# EAGLE design maplebacon-bom5k (EAGLE 5.11)
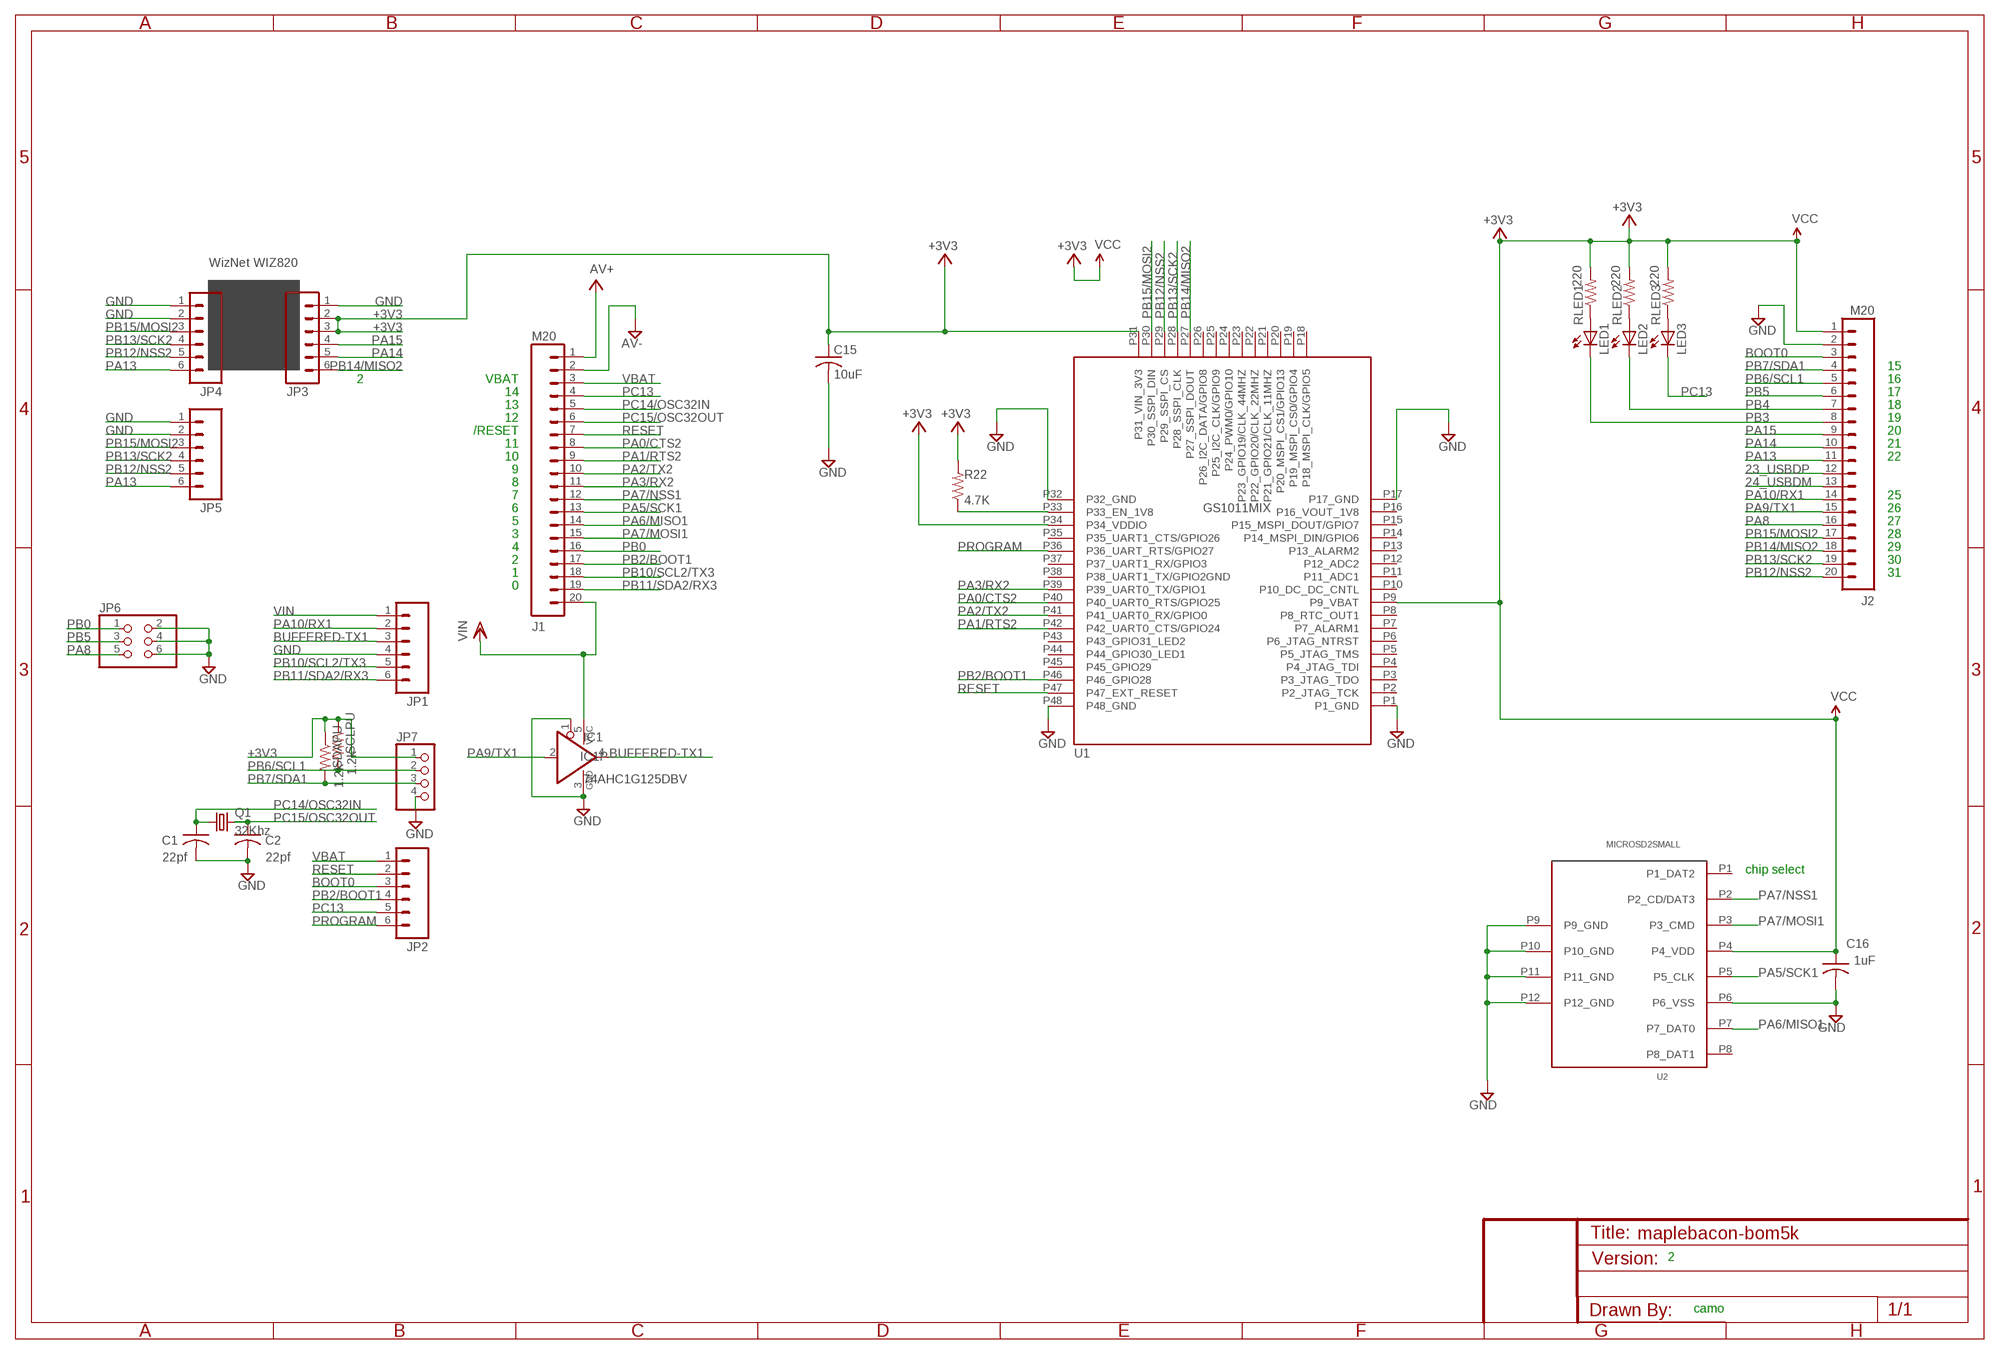
[diagram p0: schematic, sheet 1]

## Parts
C1  22pf  C-USC0603  [C0603]
C2  22pf  C-USC0603  [C0603]
C15  10uF  C-USC0603  [C0603]
C16  1uF  C-USC0603  [C0603]
IC1  74AHC1G125DBV  [SOT23-5]
J1  M20  [1X20]
J2  M20  [1X20]
JP1  M06SIP  [1X06]
JP2  M06SIP  [1X06]
JP3  M06SIP  [1X06]
JP4  M06SIP  [1X06]
JP5  M06SIP  [1X06]
JP6  PINHD-2X3  [2X03]
JP7  PINHD-1X4  [1X04]
LED1  LED3MM  [LED3MM]
LED2  LED3MM  [LED3MM]
LED3  LED3MM  [LED3MM]
Q1  32Khz  CRYSTALTC38H  [TC38H]
R22  4.7K  R-US_R0603  [R0603]
RLED1  220  R-US_R0603  [R0603]
RLED2  220  R-US_R0603  [R0603]
RLED3  220  R-US_R0603  [R0603]
SCLPU  1.2k  R-US_R0603  [R0603]
SDAPU  1.2k  R-US_R0603  [R0603]
U1  GS1011MIX  [GS1011MIX]
U2  MICROSD2SMALL  [MICROSD3]

## Nets
23_USBDP: J2.12
24_USBDM: J2.13
+3V3: C15.1 C16.1 J2.1 JP3.2 JP3.3 JP7.1 R22.2 RLED1.2 RLED2.2 RLED3.2 SCLPU.1 SDAPU.1 U1.P9(P9_VBAT) U1.P31(P31_VIN_3V3) U1.P34(P34_VDDIO) U2.P4(P4_VDD) ; supply symbol labelled VCC
AGND: J1.2 ; supply symbol labelled AV-
BOOT0: J2.3 JP2.3
BUFFERED-TX1: IC1.4(O) JP1.3
GND: C1.2 C2.2 C15.2 C16.2 IC1.1(OE) IC1.3(GND) J2.2 JP1.4 JP3.1 JP4.1 JP4.2 JP5.1 JP5.2 JP6.2 JP6.4 JP6.6 JP7.4 U1.P1(P1_GND) U1.P17(P17_GND) U1.P32(P32_GND) U1.P48(P48_GND) U2.P6(P6_VSS) U2.P9(P9_GND) U2.P10(P10_GND) U2.P11(P11_GND) U2.P12(P12_GND)
N$1: LED2.A RLED2.1
N$2: LED3.A RLED3.1
N$4: LED1.A RLED1.1
N$10: R22.1 U1.P33(P33_EN_1V8)
PA0/CTS2: J1.8 U1.P40(P40_UART0_RTS/GPIO25)
PA1/RTS2: J1.9 U1.P42(P42_UART0_CTS/GPIO24)
PA2/TX2: J1.10 U1.P41(P41_UART0_RX/GPIO0)
PA3/RX2: J1.11 U1.P39(P39_UART0_TX/GPIO1)
PA5/SCK1: J1.13 U2.P5(P5_CLK)
PA6/MISO1: J1.14 U2.P7(P7_DAT0)
PA7/MOSI1: J1.15 U2.P3(P3_CMD)
PA7/NSS1: J1.12 U2.P2(P2_CD/DAT3)
PA8: J2.16 JP6.5
PA9/TX1: IC1.2(I) J2.15
PA10/RX1: J2.14 JP1.2
PA13: J2.11 JP4.6 JP5.6
PA14: J2.10 JP3.5
PA15: J2.9 JP3.4
PB0: J1.16 JP6.1
PB2/BOOT1: J1.17 JP2.4 U1.P46(P46_GPIO28)
PB3: J2.8 LED1.K(C)
PB4: J2.7 LED2.K(C)
PB5: J2.6 JP6.3
PB6/SCL1: J2.5 JP7.2 SCLPU.2
PB7/SDA1: J2.4 JP7.3 SDAPU.2
PB10/SCL2/TX3: J1.18 JP1.5
PB11/SDA2/RX3: J1.19 JP1.6
PB12/NSS2: J2.20 JP4.5 JP5.5 U1.P29(P29_SSPI_CS)
PB13/SCK2: J2.19 JP4.4 JP5.4 U1.P28(P28_SSPI_CLK)
PB14/MISO2: J2.18 JP3.6 U1.P27(P27_SSPI_DOUT)
PB15/MOSI2: J2.17 JP4.3 JP5.3 U1.P30(P30_SSPI_DIN)
PC13: J1.4 JP2.5 LED3.K(C)
PC14/OSC32IN: C1.1 J1.5 Q1.1
PC15/OSC32OUT: C2.1 J1.6 Q1.2
PROGRAM: JP2.6 U1.P36(P36_UART_RTS/GPIO27)
RESET: J1.7 JP2.2 U1.P47(P47_EXT_RESET)
V+: J1.1 ; supply symbol labelled AV+
VBAT: J1.3 JP2.1
VIN: IC1.5(VCC) J1.20 JP1.1
Unconnected: U1.P2(P2_JTAG_TCK) U1.P3(P3_JTAG_TDO) U1.P4(P4_JTAG_TDI) U1.P5(P5_JTAG_TMS) U1.P6(P6_JTAG_NTRST) U1.P7(P7_ALARM1) U1.P8(P8_RTC_OUT1) U1.P10(P10_DC_DC_CNTL) U1.P11(P11_ADC1) U1.P12(P12_ADC2) U1.P13(P13_ALARM2) U1.P14(P14_MSPI_DIN/GPIO6) U1.P15(P15_MSPI_DOUT/GPIO7) U1.P16(P16_VOUT_1V8) U1.P18(P18_MSPI_CLK/GPIO5) U1.P19(P19_MSPI_CS0/GPIO4) U1.P20(P20_MSPI_CS1/GPIO13) U1.P21(P21_GPIO21/CLK_11MHZ) U1.P22(P22_GPIO20/CLK_22MHZ) U1.P23(P23_GPIO19/CLK_44MHZ) U1.P24(P24_PWM0/GPIO10) U1.P25(P25_I2C_CLK/GPIO9) U1.P26(P26_I2C_DATA/GPIO8) U1.P35(P35_UART1_CTS/GPIO26) U1.P37(P37_UART1_RX/GPIO3) U1.P38(P38_UART1_TX/GPIO2GND) U1.P43(P43_GPIO31_LED2) U1.P44(P44_GPIO30_LED1) U1.P45(P45_GPIO29) U2.P1(P1_DAT2) U2.P8(P8_DAT1)

## Notes on the sheet
- WizNet WIZ820
- 15
- 2 | VBAT | 16
- 14 | 17
- 13 | 18
- 12 | 19
- /RESET | 20
- 11 | 21
- 10 | 22
- 9
- 8
- 7 | 25
- 6 | 26
- 5 | 27
- 3 | 28
- 4 | 29
- 2 | 30
- 1 | 31
- 0
- chip select
- 2
- camo

## Library data of the parts
C1 C2 C15 C16 = rcl:C-US: CAPACITOR, American symbol
IC1 = 74xx-little-de:74*1G125: Single Bus Buffer Gate with 3-State Output
J1 J2 = SparkFun3:M20: This is just like the LOCK variant in that the holes are staggared by 5 mil, but except for the last two holes. They are not altered from the "standard" footprint layout. This is used for a special purpose on the layout of our Graphic LCD Backpack. Make sure you want to use this device before selecting it for you project!
JP1-JP5 = 3d:M06: Header 6 Standard 6-pin 0.1" header. Use with straight break away headers (SKU : PRT-00116), right angle break away headers (PRT-00553), swiss pins (PRT-00743), machine pins (PRT-00117), and female headers (PRT-00115). Molex polarized connector foot print use with SKU : PRT-08094 with associated crimp pins and housings.
JP6 = pinhead:PINHD-2X3: PIN HEADER
JP7 = 3d2010:PINHD-1X4: PIN HEADER
LED1-LED3 = led:LED: LED OSRAM: - CHIPLED LG R971, LG N971, LY N971, LG Q971, LY Q971, LO R971, LY R971 LH N974, LH R974 LS Q976, LO Q976, LY Q976 LO Q996 - Hyper CHIPLED LW Q18S LB Q993, LB Q99A, LB R99A - SideLED LS A670, LO A670, LY A670, LG A670, LP A670 LB A673, LV A673, LT A673, LW A673 LH A674 LY A675 LS A676, LA A676, LO A676, LY A676, LW A676 LS A679, LY A679, LG A679 - Hyper Micro SIDELED® LS Y876, LA Y876, LO Y876, LY Y876 LT Y87S - SmartLED LW L88C, LW L88S LB L89C, LB L89S, LG L890 LS L89K, LO L89K, LY L89K LS L896, LA L896, LO L896, LY L896 - TOPLED LS T670, LO T670, LY T670, LG T670, LP T670 LSG T670, LSP T670, LSY T670, LOP T670, LYG T670 LG T671, LOG T671, LSG T671 LB T673, LV T673, LT T673, LW T673 LH T674 LS T676, LA T676, LO T676, LY T676, LB T676, LH T676, LSB T676, LW T676 LB T67C, LV T67C, LT T67C, LS T67K, LO T67K, LY T67K, LW E67C LS E67B, LA E67B, LO E67B, LY E67B, LB E67C, LV E67C, LT E67C LW T67C LS T679, LY T679, LG T679 LS T770, LO T770, LY T770, LG T770, LP T770 LB T773, LV T773, LT T773, LW T773 LH T774 LS E675, LA E675, LY E675, LS T675 LS T776, LA T776, LO T776, LY T776, LB T776 LHGB T686 LT T68C, LB T68C - Hyper Mini TOPLED® LB M676 - Mini TOPLED Santana® LG M470 LS M47K, LO M47K, LY M47K Source: http://www.osram.convergy.de LUXEON: - LUMILED® LXK2-PW12-R00, LXK2-PW12-S00, LXK2-PW14-U00, LXK2-PW14-V00 LXK2-PM12-R00, LXK2-PM12-S00, LXK2-PM14-U00 LXK2-PE12-Q00, LXK2-PE12-R00, LXK2-PE12-S00, LXK2-PE14-T00, LXK2-PE14-U00 LXK2-PB12-K00, LXK2-PB12-L00, LXK2-PB12-M00, LXK2-PB14-N00, LXK2-PB14-P00, LXK2-PB14-Q00 LXK2-PR12-L00, LXK2-PR12-M00, LXK2-PR14-Q00, LXK2-PR14-R00 LXK2-PD12-Q00, LXK2-PD12-R00, LXK2-PD12-S00 LXK2-PH12-R00, LXK2-PH12-S00 LXK2-PL12-P00, LXK2-PL12-Q00, LXK2-PL12-R00 Source: www.luxeon.com KINGBRIGHT: KA-3528ASYC Source: www.kingbright.com
Q1 = crystal:CRYSTAL: CRYSTAL; OC_FARNELL: unknown; OC_NEWARK: unknown
R22 RLED1-RLED3 SCLPU SDAPU = rcl:R-US_: RESISTOR, American symbol
U1 = diysandbox:GS1011MIX
U2 = diysandbox:MICROSD2: 4UCON - Part Number: 15882 - microSD

## Net classes
0 default: width 0.203 mm
1 vcc: width 0.254 mm

## Board
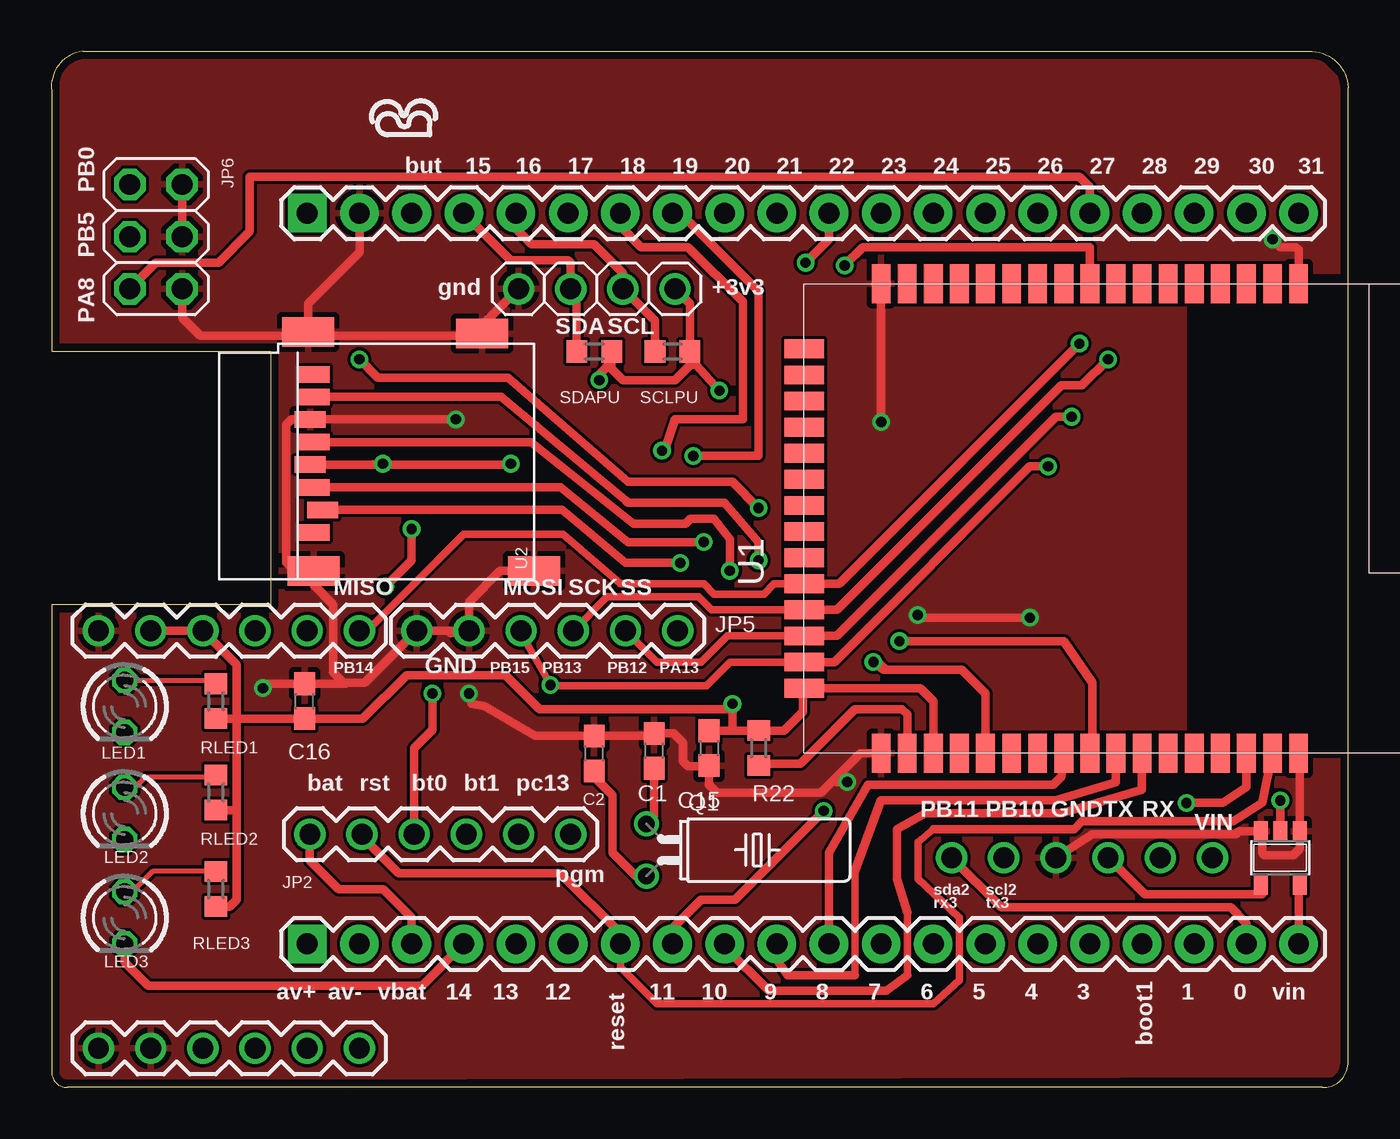
[diagram p1: board, top side]
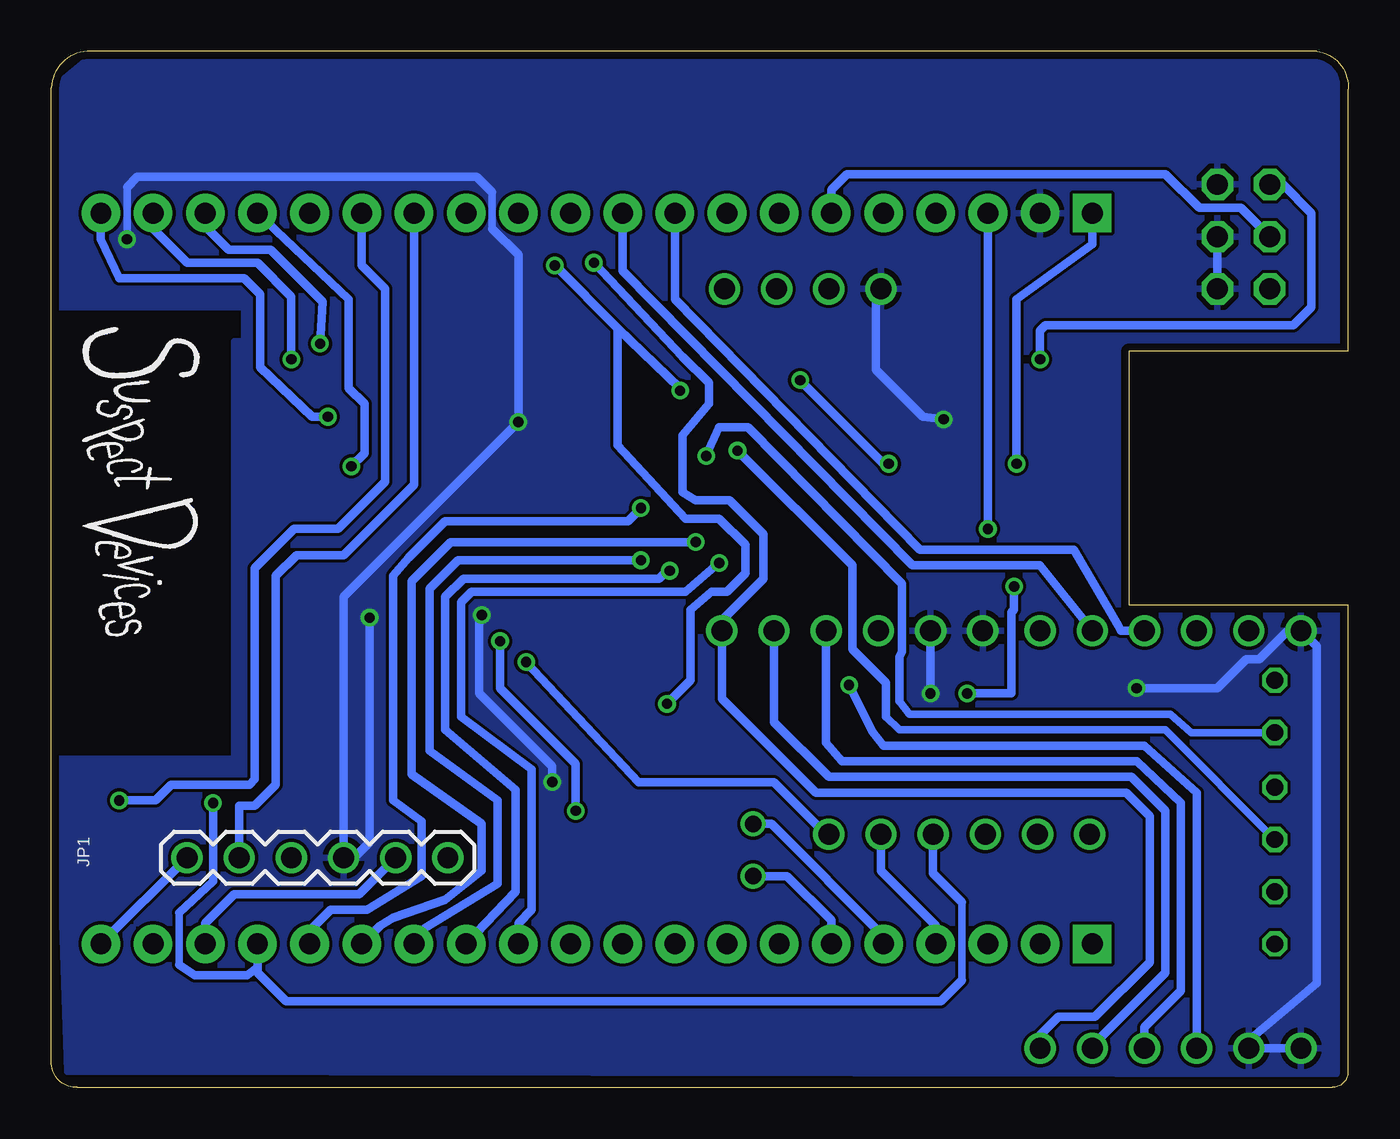
[diagram p2: board, bottom side, seen from below]

Size 63.13 x 50.42 mm. Coordinates in mm from the lower left corner, seen from the top.
Outline: 1.53,50.42 61.22,50.42 arc-90 63.13,48.64 63.13,1.14 arc-90 61.86,0 0.77,0 arc-90 0.01,0.76 0.01,23.5 10.68,23.5 10.68,35.81 0.01,35.81 0.01,48.51 arc-90 1.53,50.42
Copper layers (1*16): Top 0.0356mm / dielectric 1.5011mm / Bottom 0.0356mm
Design rules "LaenPCBOrder": minimum track width 6mil, minimum drill 13mil, track to track 6mil, track to pad 6mil, pad to pad 6mil, via to via 6mil, smd to smd 6mil, copper to edge 15mil, drill to drill 6mil, minimum pad ring 7mil, minimum via ring 7mil, stop-mask expansion 4mil, vias tented up to drill 0mil, thermal gap 10mil

### Footprints (pad centres in the part's own frame; a part is rotated, then mirrored left to right if it is on the bottom)
C0603 = smd 1.1 x 1: 1 -0.85,0; 2 0.85,0
SOT23-5 = smd 0.69 x 0.99: 1 -0.95,-1.29; 2 0,-1.29; 3 0.95,-1.29; 4 0.95,1.3; 5 -0.95,1.3
1X20 = drill 1.016 pad 1.88 square: 1 0,0 | drill 1.016 pad 1.88 round: 2 2.54,0; 3 5.08,0; 4 7.62,0; 5 10.16,0; 6 12.7,0; 7 15.24,0; 8 17.78,0; 9 20.32,0; 10 22.86,0; 11 25.4,0; 12 27.94,0; 13 30.48,0; 14 33.02,0; 15 35.56,0; 16 38.1,0; 17 40.64,0; 18 43.18,0; 19 45.72,0; 20 48.26,0
1X06 = drill 1.016 round: 1 0,0; 2 2.54,0; 3 5.08,0; 4 7.62,0; 5 10.16,0; 6 12.7,0
2X03 = drill 1.016 octagon: 1 -2.54,-1.27; 2 -2.54,1.27; 3 0,-1.27; 4 0,1.27; 5 2.54,-1.27; 6 2.54,1.27
1X04 = drill 1.016 round: 1 -3.81,0; 2 -1.27,0; 3 1.27,0; 4 3.81,0
LED3MM = drill 0.813 octagon: A -1.27,0; K 1.27,0
TC38H = drill 0.813 round: 1 -1.27,0; 2 1.27,0
R0603 = smd 1 x 1.1: 1 -0.85,0; 2 0.85,0
GS1011MIX = smd 1.905 x 0.914: P1 22.86,8.509; P2 22.86,9.779; P3 22.86,11.049; P4 22.86,12.319; P5 22.86,13.589; P6 22.86,14.859; P7 22.86,16.129; P8 22.86,17.399; P9 22.86,18.669; P10 22.86,19.939; P11 22.86,21.209; P12 22.86,22.479; P13 22.86,23.749; P14 22.86,25.019; P15 22.86,26.289; P16 22.86,27.559; P17 22.86,28.829; P32 0,28.829; P33 0,27.559; P34 0,26.289; P35 0,25.019; P36 0,23.749; P37 0,22.479; P38 0,21.209; P39 0,19.939; P40 0,18.669; P41 0,17.399; P42 0,16.129; P43 0,14.859; P44 0,13.589; P45 0,12.319; P46 0,11.049; P47 0,9.779; P48 0,8.509 | smd 0.914 x 1.905: P18 19.685,32.575; P19 18.415,32.575; P20 17.145,32.575; P21 15.875,32.575; P22 14.605,32.575; P23 13.335,32.575; P24 12.065,32.575; P25 10.795,32.575; P26 9.525,32.575; P27 8.255,32.575; P28 6.985,32.575; P29 5.715,32.575; P30 4.445,32.575; P31 3.175,32.575
MICROSD3 = smd 0.8 x 1.5: P1 -9.19,10.7; P2 -8.09,10.3; P3 -6.99,10.7; P4 -5.89,10.9; P5 -4.79,10.7; P6 -3.69,10.9; P7 -2.59,10.7; P8 -1.49,10.7 | smd 1.422 x 2.54: P9 -11.06,0; P10 0.49,2.54; P11 0.57,11.01; P12 -11.06,10.74

### Placement (x,y rotation side)
C1  29.35,16.38 90 top
C2  26.43,16.26 90 top
C15  32.01,16.51 270 top
C16  12.33,18.8 90 top
IC1  59.83,11.18 180 top
J1  12.46,6.99 0 top
J2  12.46,42.55 0 top
JP1  56.53,11.18 0 bottom
JP2  12.58,12.32 0 top
JP3  2.3,22.23 0 top
JP4  2.3,1.91 0 top
JP5  17.79,22.23 0 top
JP6  5.09,41.4 270 top
JP7  26.55,38.86 180 top
LED1  3.57,18.54 270 top
LED2  3.57,13.34 270 top
LED3  3.57,8.26 270 top
Q1  28.97,11.56 270 top
R22  34.43,16.51 90 top
RLED1  8.01,18.8 270 top
RLED2  8.01,14.35 270 top
RLED3  8.01,9.65 270 top
SCLPU  30.24,35.81 180 top
SDAPU  26.43,35.81 180 top
U1  69.23,16.26 90 top
U2  23.51,36.2 90 top
U$1  [SUSDEVLOGOSM]  61.35,37.08 270 bottom

### Tracks (layer width: path | path; a pad name or v marks a point on that pad's centre or on a via)
+3V3  (via drill 0.5)
  Top 0.406: U1.P34 42.94,18.8 42.3,19.43 U1.P31 36.59,19.37 36.59,18.29 35.66,17.36 R22.2 33.16,17.36 | U1.P9 50.56,40.89 39.51,40.89 v38.62,40.01 | 33.16,17.36 C15.1 | JP3.2 JP3.3 9.03,20.57 9.03,18.07 9.15,17.95 | 33.16,17.36 v33.16,18.67 32.9,18.42 23.76,18.42 22.11,20.07 17.28,20.07 15.16,17.95 C16.1 9.15,17.95 | 8.9,17.95 RLED1.2 | 8.9,17.95 9.15,17.95 | RLED2.2 8.94,13.5 9.03,13.59 | 9.03,13.59 9.03,17.82 8.9,17.95 | RLED3.2 8.69,8.8 9.03,9.14 9.03,13.59 | JP7.1 31.09,38.14 SCLPU.1 31.13,35.78 31.13,35.18 | 27.28,35.31 27.28,34.96 27.82,34.42 30.36,34.42 31.13,35.18 | 27.28,35.31 SDAPU.1 | v16.14,30.35 15.08,30.31 U2.P4 22.31,30.31 v22.36,30.35 | 31.13,35.18 31.38,35.18 v32.52,33.91 | v26.68,34.42 26.68,34.71 27.28,35.31
  Bottom 0.406: 35.57,36.96 v38.62,40.01 | 35.57,36.96 35.57,31.24 32.27,27.69 30.62,27.69 29.35,26.42 29.35,25.02 30.24,24.13 31,24.13 32.01,23.24 32.01,19.81 v33.16,18.67 | v16.14,30.35 16.14,38.35 12.46,41.02 J2.1 | v32.52,33.91 32.52,34.04 35.57,36.96 | v22.36,30.35 22.62,30.35 v26.68,34.42
BOOT0  (via drill 0.5)
  Top 0.406: JP2.3 17.66,16.51 18.55,17.4 v18.55,19.18 | v17.54,27.18 17.54,25.65 v16.27,24.38
  Bottom 0.406: v18.55,19.18 16.39,19.18 16.39,23.11 16.27,23.24 v16.27,24.38 | v17.54,27.18 J2.3
BUFFERED-TX1
  Top 0.406: IC1.4 58.94,9.88 58.94,9.4 53.22,9.4 JP1.3
GND  (via drill 0.5)
  Top 0.406: U1.P48 60.78,16.2 IC1.1 60.78,11.62 60.46,11.3 59.07,11.3 58.94,11.43 58.94,12.41 IC1.3 57.82,12.47 57.67,12.32 50.68,12.32 JP1.4 | U1.P32 39.38,16.26 38.11,14.99 | 38.11,14.99 37.48,14.35 32.4,14.35 32.01,14.73 C15.2 31.98,15.62 31,15.62 30.74,15.88 30.74,16.76 30.28,17.23 C1.2 29.22,17.11 C2.2 23.54,17.11 21.09,18.54 20.46,18.67 v20.33,19.18 | U1.P1 60.72,40.77 60.59,40.89 59.83,40.89 v59.45,41.28 | v40.4,32.39 U1.P17 | v47.64,22.86 42.3,22.86 v42.17,22.99 | v38.75,14.86 38.24,14.86 38.11,14.99 | JP5.2 JP5.1 15.25,19.69 14.36,19.69 | JP5.2 20.33,23.62 21.85,25.15 23.49,25.15 U2.P9 | 14.36,19.69 14.23,19.69 13.73,20.19 13.73,23.5 12.77,24.46 U2.P12 11.83,25.14 11.44,25.53 11.44,32.26 11.69,32.51 12.6,32.51 U2.P6 v19.7,32.51 | 14.36,19.69 14.32,19.65 C16.2 10.51,19.65 v10.3,19.43 | JP5.2 19.44,22.1 | JP7.4 20.97,37.08 U2.P10 20.86,36.58 12.31,36.58 | J2.2 15,40.64 12.5,38.14 U2.P11 12.31,36.58 | JP6.6 6.36,37.47 7.25,36.58 12.31,36.58 | JP6.4 JP6.2
  Bottom 0.356: 59.45,43.82 v59.45,41.28 | 41.67,41.78 41.67,43.56
  Bottom 0.406: v47.64,22.86 47.64,11.94 48.4,11.18 JP1.4 48.91,23.88 v40.4,32.39 40.4,40.51 41.67,41.78 | v42.17,22.99 42.17,22.73 42.3,22.61 42.3,19.18 38.75,15.62 v38.75,14.86 | JP4.1 JP4.2 4.84,2.29 1.53,5.08 1.53,21.46 JP3.1 2.93,22.23 4.33,20.83 4.96,20.83 6.36,19.43 v10.3,19.43 | JP5.2 v20.33,19.18 | 59.45,43.82 58.94,44.32 42.43,44.32 41.67,43.56 | v19.7,32.51 20.71,32.64 23,34.93 23,38.61 JP7.4 | JP6.6 JP6.4
  pour Bottom: -1.39,0.64 -1.26,25.4 0.39,25.78 9.92,25.78 10.04,35.18 0.39,35.18 0.39,48.9 arc-90 1.53,50.04 1.92,50.04 61.22,50.17 62.75,48.9 62.88,37.97 53.73,37.97 53.73,36.32 54.24,36.32 54.24,16 62.88,16 62.37,0.76
  pour Top: -1.01,0.51 -0.88,25.65 9.92,25.78 9.79,35.69 0.26,35.69 0.39,48.9 arc-90 1.53,50.04 61.61,50.04 62.75,48.9 62.88,39.75 55.13,39.75 55.13,15.88 62.88,15.88 62.62,0.64
N$1
  Top 0.254: LED2.A 4.07,14.61 4.58,15.11 7.92,15.11 RLED2.1
N$2
  Top 0.254: LED3.A 3.95,9.53 4.96,10.54 7.97,10.54 RLED3.1
N$4
  Top 0.254: LED1.A 7.85,19.81 RLED1.1
N$10
  Top 0.406: U1.P33 41.67,18.16 41.41,18.42 39.13,18.42 36.46,15.75 34.52,15.75 R22.1
PA0/CTS2  (via drill 0.5)
  Top 0.406: J1.8 30.24,7.75 31.63,9.14 33.28,9.14 v37.6,13.46 | v41.29,21.72 49.29,21.72 50.68,19.69 50.68,16.38 U1.P40
  Bottom 0.406: v37.6,13.46 37.6,15.75 41.29,19.43 v41.29,21.72
PA1/RTS2
  Top 0.356: 41.67,5.46 41.67,8.51
  Top 0.406: U1.P42 53.1,14.48 49.16,13.34 42.56,13.34 41.16,12.57 41.16,10.16 41.67,8.51 | J1.9 32.78,6.86 34.94,4.7 40.65,4.7 41.67,5.46
PA2/TX2
  Top 0.356: 39.13,5.46 39.13,10.54
  Top 0.406: J1.10 35.32,6.22 35.82,5.46 39.13,5.46 | 39.13,10.54 40.4,13.97 48.91,13.97 51.83,14.86 U1.P41
PA3/RX2
  Top 0.406: U1.P39 49.16,15.11 48.78,14.73 39.76,14.73 37.86,11.43 J1.11
PA5/SCK1  (via drill 0.5)
  Top 0.406: U2.P5 23.34,31.41 28.33,27.43 30.87,27.43 31.13,27.69 32.27,27.69 33.03,26.67 v33.03,25.15
  Bottom 0.406: J1.13 40.52,9.53 40.52,14.48 43.95,17.4 43.95,23.88 43.06,24.77 33.54,24.77 33.16,25.15 v33.03,25.15
PA6/MISO1  (via drill 0.5)
  Top 0.406: U2.P7 21.9,33.61 27.95,28.58 28.08,28.45 32.78,28.45 34.43,26.54 v34.43,25.65
  Bottom 0.406: J1.14 44.97,7.75 41.41,9.91 41.41,13.97 44.71,16.38 44.71,24.26 43.32,25.65 v34.43,25.65
PA7/MOSI1  (via drill 0.5)
  Top 0.406: U2.P3 24.78,29.21 28.08,26.54 v31.76,26.54
  Bottom 0.406: J1.15 47.13,7.87 46.49,8.26 43.95,9.14 42.17,10.54 42.17,12.83 45.6,15.24 45.6,24.64 43.7,26.54 v31.76,26.54
PA7/NSS1  (via drill 0.5)
  Top 0.406: U2.P2 24.86,28.11 27.95,25.53 v30.62,25.53
  Bottom 0.406: J1.12 40.4,8 39.76,8.64 39.76,15.49 43.19,18.03 43.19,23.62 42.68,24.13 32.27,24.13 v30.62,25.53
PA8
  Top 0.406: J2.16 50.56,43.82 50.05,44.32 9.66,44.32 9.66,41.66 8.14,40.13 5.09,40.13 JP6.5
PA9/TX1  (via drill 0.5)
  Top 0.406: v59.83,13.97 IC1.2
  Bottom 0.406: v59.83,13.97 58.05,13.97 57.29,14.73 53.48,14.73 53.22,14.99 53.22,25.27 51.32,27.18 49.16,27.18 46.87,29.46 46.87,38.86 48.02,40.01 J2.15
PA10/RX1
  Bottom 0.406: JP1.2 53.99,13.72 53.22,13.72 52.21,14.73 52.21,24.89 51.19,25.91 48.91,25.91 45.48,29.34 J2.14
PA13  (via drill 0.5)
  Top 0.406: J2.11 37.86,41.28 v36.71,40.13
  Bottom 0.406: v36.71,40.13 32.4,35.56 31.13,34.29 31.13,33.27 32.4,31.75 32.4,28.96 31.76,28.58 30.11,28.58 28.46,26.92 28.46,24.77 30.49,22.73 JP5.6 30.49,18.92 25.92,14.35 10.81,14.35 9.66,13.21 9.66,6.1 12.33,3.43 14.11,3.43 15,2.54 JP4.6
PA14
  Bottom 0.406: J2.10 35.32,39.75 21.22,25.4 15,25.4 JP3.5
PA15
  Bottom 0.406: J2.9 32.78,38.35 20.84,26.16 13.35,26.16 11.19,22.48 11.06,22.23 JP3.4
PB0  (via drill 0.5)
  Top 0.406: v34.43,28.19 33.16,29.46 28.08,29.46 22.24,34.54 15.89,34.54 v15,35.43
  Bottom 0.406: J1.16 50.56,7.62 49.54,8.64 47.76,8.64 45.1,10.29 45.1,12.95 46.49,13.97 46.49,24.89 45.73,25.78 43.95,27.56 35.06,27.56 v34.43,28.19 | JP6.1 3.19,43.94 1.79,42.55 1.79,37.97 2.68,37.08 14.74,37.08 15,36.83 v15,35.43
PB2/BOOT1  (via drill 0.5)
  Top 0.406: U1.P46 58.18,14.61 57.03,13.84 v55.26,13.84
  Bottom 0.356: 56.91,5.97 56.91,8.51 | 18.81,5.21 18.81,9.02
  Bottom 0.406: v55.26,13.84 55.26,10.03 56.91,8.51 | 56.91,5.97 56.14,5.46 53.6,5.46 53.1,5.84 J1.17 53.1,5.59 51.7,4.19 19.82,4.19 18.81,5.21 | 18.81,9.02 20.2,10.41 JP2.4
PB3  (via drill 0.5)
  Top 0.406: J2.8 30.62,42.55 34.43,38.74 34.43,30.73 v31.25,30.73
  Bottom 0.356: LED1.K 7.63,17.27 8.65,18.16 21.35,18.16 21.85,18.8
  Bottom 0.406: 21.85,18.8 21.85,20.96 21.73,21.21 21.73,24.51 29.22,32.13 30.62,32.13 v31.25,30.73
PB4  (via drill 0.5)
  Top 0.406: J2.7 27.7,41.91 28.71,40.89 31,40.89 33.67,38.23 33.67,32.51 30.36,32.51 29.86,30.99 v29.73,30.99
  Bottom 0.356: LED2.K 8.9,17.4 21.85,17.4 22.49,18.03
  Bottom 0.406: 22.49,18.03 22.49,19.69 24.14,21.34 24.14,25.4 v29.73,30.99
PB5
  Bottom 0.406: J2.6 25.16,43.69 24.39,44.45 8.9,44.45 7.25,42.8 5.22,42.8 JP6.3
PB6/SCL1
  Top 0.406: SCLPU.2 29.39,37.3 JP7.2 27.82,39.62 26.43,41.02 23.38,41.02 22.62,41.78 J2.5
PB7/SDA1
  Top 0.406: SDAPU.2 25.58,38.57 JP7.3 25.28,40.13 25.16,40.26 22.36,40.26 J2.4
PB10/SCL2/TX3
  Bottom 0.406: J1.18 55.64,8 54.24,9.4 48.14,9.4 JP1.5
PB11/SDA2/RX3
  Top 0.406: J1.19 58.18,8 57.41,8.76 46.24,8.76 JP1.6
PB12/NSS2  (via drill 0.5)
  Top 0.356: U1.P29 32.9,21.97 31.63,20.7 29.47,20.7 JP5.5
  Top 0.406: U1.P29 38.24,21.97 48.91,32.64 v49.67,32.64
  Bottom 0.406: J2.20 60.72,41.28 59.83,39.37 53.73,39.37 52.97,38.61 52.97,35.05 50.43,32.64 v49.67,32.64 | JP4.5 12.46,2.03 8.9,5.59 8.9,13.46 10.55,15.11 25.28,15.11 27.95,17.78 JP5.5
PB13/SCK2  (via drill 0.5)
  Top 0.356: U1.P28 32.14,23.24 31.51,23.88 27.06,23.88 JP5.4
  Top 0.406: U1.P28 38.24,23.24 49.16,34.16 50.18,34.16 v51.45,35.43
  Bottom 0.406: v51.45,35.43 51.45,38.48 53.1,40.13 56.53,40.13 58.18,41.78 J2.19 | JP4.4 9.92,2.92 8.14,4.7 8.14,13.84 10.3,15.88 24.65,15.88 25.41,16.76 JP5.4
PB14/MISO2  (via drill 0.5)
  Top 0.356: U1.P27 35.19,24.51 34.68,24 32.27,24 31.76,24.51 27.7,24.51 24.9,26.92 20.08,26.92 15.5,22.35 JP3.6
  Top 0.406: U1.P27 38.36,24.51 v50.05,36.2 49.92,36.07
  Bottom 0.406: v50.05,36.2 49.92,38.23 52.46,40.77 54.49,40.77 55.76,42.04 55.76,42.42 J2.18
PB15/MOSI2  (via drill 0.5)
  Top 0.356: U1.P30 33.03,20.7 31.89,19.56 24.65,19.56 v24.3,19.59 22.87,22.1 JP5.3
  Top 0.406: U1.P30 38.11,20.7 47.64,30.23 v48.52,30.23
  Bottom 0.406: J2.17 48.65,38.35 48.65,34.04 47.89,33.27 47.89,30.86 v48.52,30.23 | JP4.3 7.38,14.35 9.92,16.64 22.62,16.64 23.16,17.3 v24.3,19.59
PC13
  Top 0.406: LED3.K 3.57,6.1 4.71,4.95 18.04,4.95 J1.4
  Bottom 0.406: J1.4 20.08,7.87 22.74,10.54 JP2.5
PC14/OSC32IN
  Top 0.406: C1.1 29.35,13.21 Q1.1
  Bottom 0.406: J1.5 22.62,7.37 28.08,12.83 Q1.1
PC15/OSC32OUT
  Top 0.406: C2.1 26.43,15.11 27.32,14.22 27.32,11.43 28.46,10.29 Q1.2
  Bottom 0.406: J1.6 25.16,8.13 27.32,10.29 Q1.2
PROGRAM  (via drill 0.5)
  Top 0.406: U1.P36 45.48,19.18 44.33,20.32 40.65,20.32 | 40.65,20.32 40.52,20.32 v40.02,20.7 40.4,20.57 40.65,20.32
  Bottom 0.406: JP2.6 25.41,12.32 27.95,14.86 34.55,14.86 v40.02,20.7
RESET
  Top 0.356: J1.7 27.7,5.84 29.47,4.06 42.94,4.06 44.21,5.21 44.21,8.26 42.17,10.16 42.17,11.94 42.94,12.57
  Top 0.406: U1.P47 58.94,13.84 57.54,12.95 50.18,12.95 49.79,12.57 42.94,12.57 | JP2.2 15.12,12.19 16.9,10.41 24.78,10.41 27.7,7.49 J1.7
VBAT
  Top 0.406: J1.3 17.54,8.26 16.14,9.65 13.98,9.65 12.58,11.05 JP2.1
VIN
  Top 0.406: J1.20 60.72,9.82 IC1.5
  Bottom 0.406: J1.20 JP1.1

### Text on the board
tNames: PB0 | but | 15 | 16 | 17 | 18 | 19 | 20 | 21 | 22 | 23 | 24 | 25 | 26 | 27 | 28 | 29 | 30 | 31 | PB5 | gnd | +3v3 | PA8 | SDA | SCL | MISO | MOSI | SCK | SS | PB14 | GND | PB15 | PB13 | PB12 | PA13 | bat | rst | bt0 | bt1 | pc13 | PB11 | PB10 | GND | TX | RX | VIN | pgm | rx3 | sda2 | scl2 | tx3 | boot1 | av+ | av- | vbat | 14 | 13 | 12 | 11 | 10 | 9 | 8 | 7 | 6 | 5 | 4 | 3 | 1 | 0 | vin | reset
tStop: BacoMatic5000 | by Suspect Devices